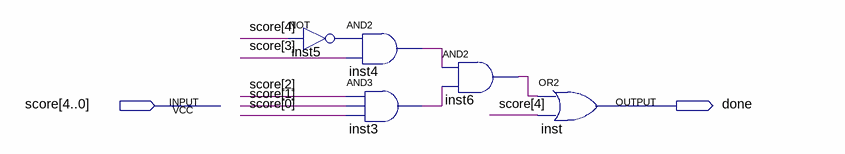
[diagram p0: schematic sheet]
// Quartus schematic Done.bdf as structural Verilog: 5 symbols, 2 pins
module Done (
  input  [4:0] score,
  output done
);

  wire inst3_out, inst4_out, inst5_out, inst6_out;

  not inst5 (inst5_out, score[4]);
  and inst4 (inst4_out, inst5_out, score[3]);
  and inst3 (inst3_out, score[2], score[1], score[0]);
  and inst6 (inst6_out, inst4_out, inst3_out);
  or inst (done, inst6_out, score[4]);
endmodule
